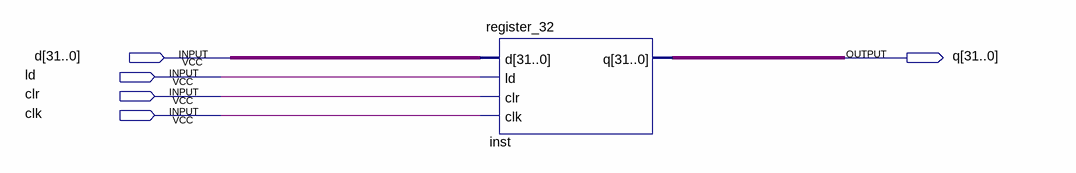
[diagram p0: schematic sheet]
// Quartus schematic q1_32.bdf as structural Verilog: 1 symbols, 5 pins
module q1_32 (
  input  [31:0] d,
  input  ld,
  input  clr,
  input  clk,
  output [31:0] q
);

  register_32 inst (.d(d), .ld(ld), .clr(clr), .clk(clk), .q(q));
endmodule
